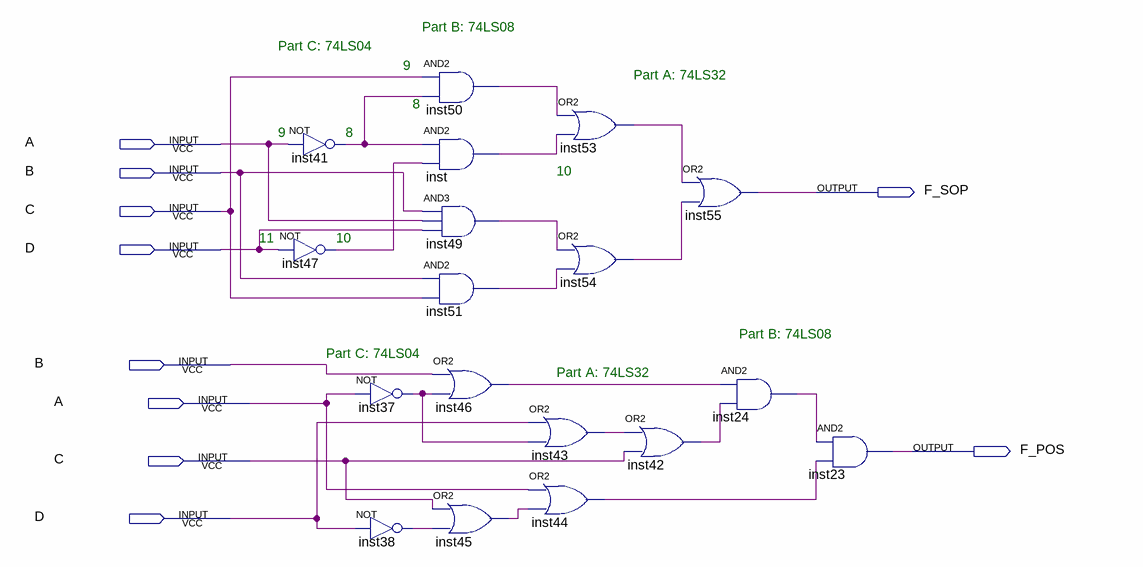
[diagram p0: schematic sheet]
// Quartus schematic ex5_tb_c.bdf as structural Verilog: 18 symbols, 10 pins
module ex5_tb_c (
  input  A,
  input  B,
  input  C,
  input  D,
  output F_SOP,
  output F_POS
);

  wire inst24_out, inst37_out, inst38_out, inst41_out, inst42_out, inst43_out, inst44_out, inst45_out,
       inst46_out, inst47_out, inst49_out, inst50_out, inst51_out, inst53_out, inst54_out, inst_out;

  not inst41 (inst41_out, A);
  not inst47 (inst47_out, D);
  not inst37 (inst37_out, A);
  not inst38 (inst38_out, D);
  and inst50 (inst50_out, C, inst41_out);
  and inst (inst_out, inst41_out, inst47_out);
  and inst49 (inst49_out, B, A, D);
  and inst51 (inst51_out, B, C);
  or inst46 (inst46_out, B, inst37_out);
  or inst45 (inst45_out, C, inst38_out);
  or inst53 (inst53_out, inst50_out, inst_out);
  or inst54 (inst54_out, inst49_out, inst51_out);
  or inst43 (inst43_out, D, inst37_out);
  or inst44 (inst44_out, A, inst45_out);
  or inst42 (inst42_out, inst43_out, C);
  or inst55 (F_SOP, inst53_out, inst54_out);
  and inst24 (inst24_out, inst46_out, inst42_out);
  and inst23 (F_POS, inst24_out, inst44_out);

  // Notes on the sheet:
  //   Part B: 74LS08
  //   Part C: 74LS04
  //   9
  //   Part A: 74LS32
  //   8
  //   9
  //   8
  //   10
  //   11
  //   10
  //   Part B: 74LS08
  //   Part C: 74LS04
  //   Part A: 74LS32
endmodule
